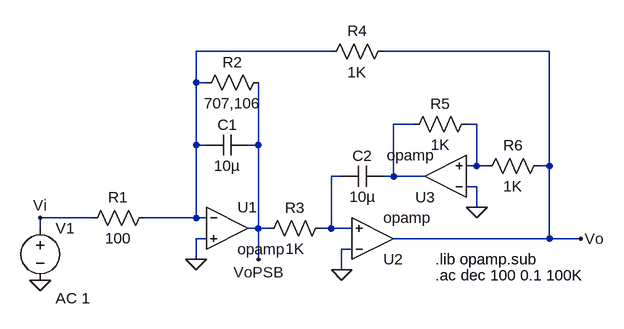
[diagram p0: schematic TPS2.asc]
TPS2.asc, the LTspice schematic file:
Version 4
SHEET 1 916 680
WIRE 288 0 80 0
WIRE 624 0 368 0
WIRE 80 48 80 0
WIRE 96 48 80 48
WIRE 416 112 384 112
WIRE 512 112 496 112
WIRE 80 144 80 48
WIRE 96 144 80 144
WIRE 176 144 176 48
WIRE 176 144 160 144
WIRE 512 176 512 112
WIRE 512 176 496 176
WIRE 528 176 512 176
WIRE 624 176 624 0
WIRE 624 176 608 176
WIRE 304 192 288 192
WIRE 384 192 384 112
WIRE 384 192 368 192
WIRE 432 192 384 192
WIRE 512 208 496 208
WIRE 512 240 512 208
WIRE -80 256 -160 256
WIRE 80 256 80 144
WIRE 80 256 0 256
WIRE 96 256 80 256
WIRE -160 272 -160 256
WIRE 176 272 176 144
WIRE 176 272 160 272
WIRE 192 272 176 272
WIRE 288 272 288 192
WIRE 288 272 272 272
WIRE 320 272 288 272
WIRE 96 288 80 288
WIRE 624 288 624 176
WIRE 624 288 384 288
WIRE 672 288 624 288
WIRE 320 304 304 304
WIRE 80 320 80 288
WIRE 176 320 176 272
WIRE 304 336 304 304
FLAG 80 320 0
FLAG -160 352 0
FLAG 304 336 0
FLAG 512 240 0
FLAG 672 288 Vo
FLAG -160 256 Vi
FLAG 176 320 VoPSB
SYMBOL res 16 240 R90
WINDOW 0 0 56 VBottom 2
WINDOW 3 32 56 VTop 2
SYMATTR InstName R1
SYMATTR Value 100
SYMBOL res 192 32 R90
WINDOW 0 0 56 VBottom 2
WINDOW 3 32 56 VTop 2
SYMATTR InstName R2
SYMATTR Value 707,106
SYMBOL cap 160 128 R90
WINDOW 0 0 32 VBottom 2
WINDOW 3 32 32 VTop 2
SYMATTR InstName C1
SYMATTR Value 10µ
SYMBOL OpAmps\\opamp 128 208 R0
SYMATTR InstName U1
SYMBOL res 288 256 R90
WINDOW 0 0 56 VBottom 2
WINDOW 3 32 56 VTop 2
SYMATTR InstName R3
SYMATTR Value 1K
SYMBOL voltage -160 256 R0
WINDOW 123 24 124 Left 2
WINDOW 39 0 0 Left 0
SYMATTR Value2 AC 1
SYMATTR InstName V1
SYMATTR Value ""
SYMBOL res 384 -16 R90
WINDOW 0 0 56 VBottom 2
WINDOW 3 32 56 VTop 2
SYMATTR InstName R4
SYMATTR Value 1K
SYMBOL OpAmps\\opamp 352 352 M180
SYMATTR InstName U2
SYMBOL cap 368 176 R90
WINDOW 0 0 32 VBottom 2
WINDOW 3 32 32 VTop 2
SYMATTR InstName C2
SYMATTR Value 10µ
SYMBOL OpAmps\\opamp 464 256 R180
SYMATTR InstName U3
SYMBOL res 624 160 R90
WINDOW 0 0 56 VBottom 2
WINDOW 3 32 56 VTop 2
SYMATTR InstName R6
SYMATTR Value 1K
SYMBOL res 512 96 R90
WINDOW 0 0 56 VBottom 2
WINDOW 3 32 56 VTop 2
SYMATTR InstName R5
SYMATTR Value 1K
TEXT 448 320 Left 2 !.lib opamp.sub
TEXT 448 344 Left 2 !.ac dec 100 0.1 100K

The netlist it stands for:
* TPS2.asc
R1 N001 Vi 100
R2 VoPSB N001 707,106
C1 VoPSB N001 10µ
XU1 N001 0 VoPSB opamp Aol=100K GBW=10Meg  ; pins invin noninvin out
R3 N004 VoPSB 1K
V1 Vi 0 AC 1
R4 Vo N001 1K
XU2 0 N004 Vo opamp Aol=100K GBW=10Meg  ; pins invin noninvin out
C2 N002 N004 10µ
XU3 0 N003 N002 opamp Aol=100K GBW=10Meg  ; pins invin noninvin out
R6 Vo N003 1K
R5 N003 N002 1K
.lib opamp.sub
.ac dec 100 0.1 100K
.backanno
.end

* Results of the author's LTspice run, read from the files saved beside the schematic
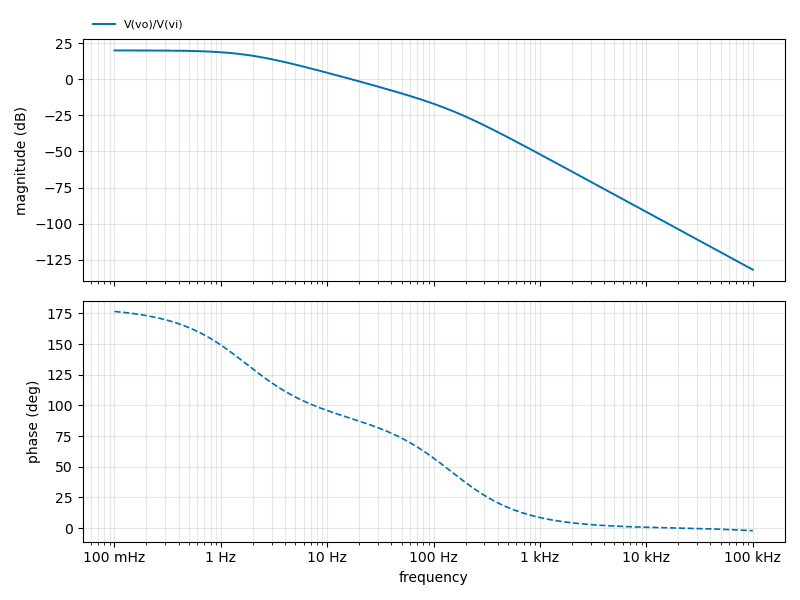
[diagram p1: AC Analysis of TPS2.asc, plotted from the saved traces]
* AC Analysis, 1 run:
*   V(vo)/V(vi): 19.98 dB at 100 mHz, -131.93 dB at 100 kHz, peak 19.98 dB at 100 mHz, 3 dB below the peak at 1.712 Hz